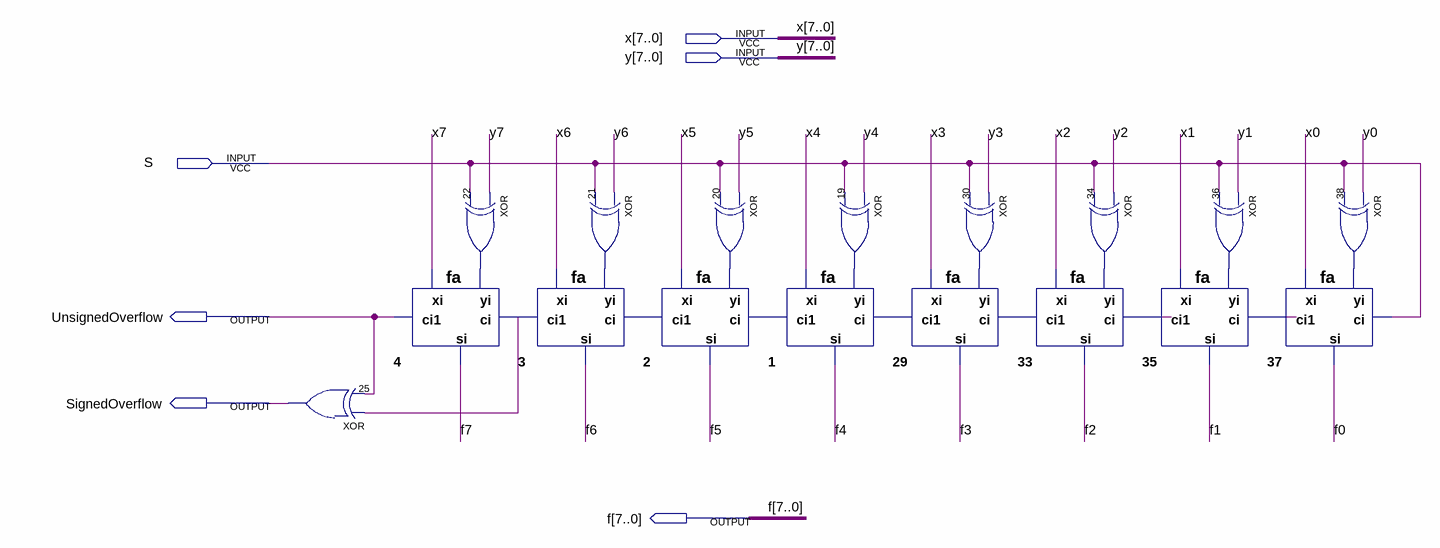
[diagram p0: schematic sheet]
// Quartus schematic addsub.bdf as structural Verilog: 17 symbols, 6 pins
module addsub (
  input  [7:0] x,
  input  [7:0] y,
  input  S,
  output UnsignedOverflow,
  output SignedOverflow,
  output [7:0] f
);

  wire n1_ci1, n2_ci1, n3_ci1, n19_out, n20_out, n21_out, n22_out, n29_ci1, n30_out, n33_ci1, n34_out,
       n35_ci1, n36_out, n37_ci1, n38_out;

  xor u_25 (SignedOverflow, n3_ci1, UnsignedOverflow);
  fa u_4 (.xi(x[7]), .ci(n3_ci1), .yi(n22_out), .ci1(UnsignedOverflow), .si(f[7]));
  xor u_22 (n22_out, y[7], S);
  fa u_3 (.xi(x[6]), .ci(n2_ci1), .yi(n21_out), .ci1(n3_ci1), .si(f[6]));
  xor u_21 (n21_out, y[6], S);
  fa u_2 (.xi(x[5]), .ci(n1_ci1), .yi(n20_out), .ci1(n2_ci1), .si(f[5]));
  xor u_20 (n20_out, y[5], S);
  xor u_19 (n19_out, y[4], S);
  fa u_1 (.xi(x[4]), .ci(n29_ci1), .yi(n19_out), .ci1(n1_ci1), .si(f[4]));
  fa u_29 (.xi(x[3]), .ci(n33_ci1), .yi(n30_out), .ci1(n29_ci1), .si(f[3]));
  xor u_30 (n30_out, y[3], S);
  fa u_33 (.xi(x[2]), .ci(n35_ci1), .yi(n34_out), .ci1(n33_ci1), .si(f[2]));
  xor u_34 (n34_out, y[2], S);
  fa u_35 (.xi(x[1]), .ci(n37_ci1), .yi(n36_out), .ci1(n35_ci1), .si(f[1]));
  xor u_36 (n36_out, y[1], S);
  fa u_37 (.xi(x[0]), .ci(S), .yi(n38_out), .ci1(n37_ci1), .si(f[0]));
  xor u_38 (n38_out, y[0], S);
endmodule
